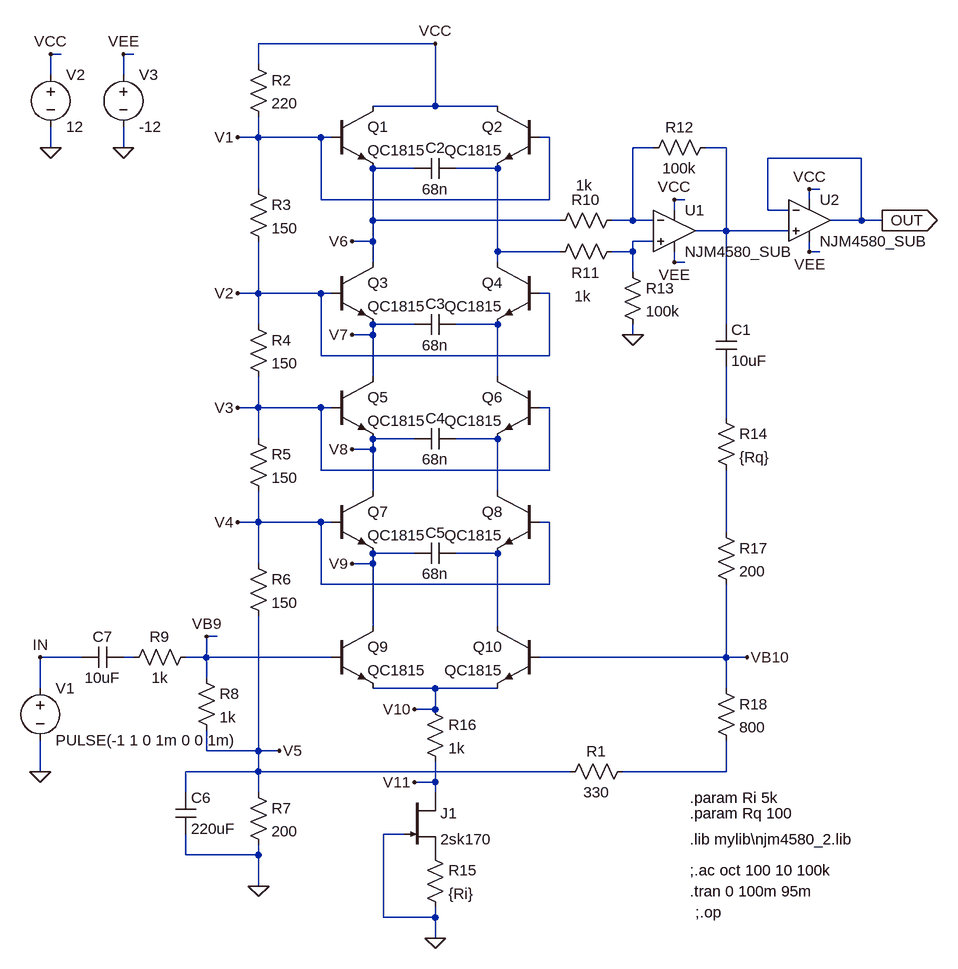
[diagram p0: schematic TLF01_V2_VF_op.asc]
TLF01_V2_VF_op.asc, the LTspice schematic file:
Version 4
SHEET 1 1344 1508
WIRE 240 -32 -32 -32
WIRE -336 -16 -352 -16
WIRE -224 -16 -240 -16
WIRE -32 0 -32 -32
WIRE -352 16 -352 -16
WIRE -240 16 -240 -16
WIRE 240 64 240 -32
WIRE 240 64 144 64
WIRE 336 64 240 64
WIRE -32 112 -32 80
WIRE -32 112 -64 112
WIRE 64 112 -32 112
WIRE 80 112 64 112
WIRE 416 112 400 112
WIRE -352 128 -352 96
WIRE -240 128 -240 96
WIRE 576 128 544 128
WIRE 688 128 656 128
WIRE 896 144 752 144
WIRE 208 160 144 160
WIRE 336 160 272 160
WIRE -32 192 -32 112
WIRE 832 192 816 192
WIRE 64 208 64 112
WIRE 416 208 416 112
WIRE 416 208 64 208
WIRE 624 208 608 208
WIRE 816 208 816 192
WIRE 608 224 608 208
WIRE 752 224 752 144
WIRE 784 224 752 224
WIRE 144 240 144 160
WIRE 432 240 144 240
WIRE 544 240 544 128
WIRE 544 240 512 240
WIRE 576 240 544 240
WIRE 896 240 896 144
WIRE 896 240 848 240
WIRE 928 240 896 240
WIRE 688 256 688 128
WIRE 688 256 640 256
WIRE 784 256 688 256
WIRE 144 272 144 240
WIRE 144 272 112 272
WIRE 576 272 544 272
WIRE 336 288 336 160
WIRE 432 288 336 288
WIRE 544 288 544 272
WIRE 544 288 512 288
WIRE 816 288 816 272
WIRE 832 288 816 288
WIRE 144 304 144 272
WIRE 336 304 336 288
WIRE 608 304 608 288
WIRE 624 304 608 304
WIRE 544 320 544 288
WIRE -32 352 -32 272
WIRE -32 352 -64 352
WIRE 64 352 -32 352
WIRE 80 352 64 352
WIRE 416 352 400 352
WIRE -32 400 -32 352
WIRE 208 400 144 400
WIRE 336 400 272 400
WIRE 688 400 688 256
WIRE 144 416 144 400
WIRE 144 416 112 416
WIRE 544 416 544 400
WIRE 64 448 64 352
WIRE 416 448 416 352
WIRE 416 448 64 448
WIRE 144 480 144 416
WIRE 336 480 336 400
WIRE -32 528 -32 480
WIRE -32 528 -64 528
WIRE 64 528 -32 528
WIRE 80 528 64 528
WIRE 416 528 400 528
WIRE 688 544 688 464
WIRE -32 576 -32 528
WIRE 208 576 144 576
WIRE 336 576 272 576
WIRE 144 592 144 576
WIRE 144 592 112 592
WIRE 64 624 64 528
WIRE 416 624 416 528
WIRE 416 624 64 624
WIRE 144 656 144 592
WIRE 336 656 336 576
WIRE -32 704 -32 656
WIRE -32 704 -64 704
WIRE 64 704 -32 704
WIRE 80 704 64 704
WIRE 416 704 400 704
WIRE 688 720 688 624
WIRE 208 752 144 752
WIRE 336 752 272 752
WIRE -32 768 -32 704
WIRE 144 768 144 752
WIRE 144 768 112 768
WIRE 64 800 64 704
WIRE 416 800 416 704
WIRE 416 800 64 800
WIRE 144 864 144 768
WIRE 336 864 336 752
WIRE -96 880 -112 880
WIRE -304 912 -368 912
WIRE -224 912 -240 912
WIRE -112 912 -112 880
WIRE -112 912 -144 912
WIRE 80 912 -112 912
WIRE 688 912 688 800
WIRE 688 912 400 912
WIRE 720 912 688 912
WIRE -112 944 -112 912
WIRE -368 960 -368 912
WIRE 240 960 144 960
WIRE 336 960 240 960
WIRE 688 960 688 912
WIRE 240 992 240 960
WIRE 240 992 208 992
WIRE -112 1056 -112 1024
WIRE -32 1056 -32 848
WIRE -32 1056 -112 1056
WIRE 0 1056 -32 1056
WIRE -368 1088 -368 1040
WIRE -32 1088 -32 1056
WIRE -32 1088 -144 1088
WIRE 448 1088 -32 1088
WIRE 688 1088 688 1040
WIRE 688 1088 528 1088
WIRE 240 1104 240 1072
WIRE 240 1104 208 1104
WIRE -144 1120 -144 1088
WIRE -32 1120 -32 1088
WIRE 240 1120 240 1104
WIRE 192 1184 160 1184
WIRE -144 1216 -144 1184
WIRE -32 1216 -32 1200
WIRE -32 1216 -144 1216
WIRE -32 1264 -32 1216
WIRE 160 1312 160 1184
WIRE 240 1312 240 1296
WIRE 240 1312 160 1312
WIRE 240 1344 240 1312
FLAG 240 1344 0
FLAG -352 128 0
FLAG -352 -16 VCC
FLAG -32 1264 0
FLAG 240 -32 VCC
FLAG -368 1088 0
FLAG -368 912 IN
FLAG -64 112 V1
FLAG -64 352 V2
FLAG -64 528 V3
FLAG -64 704 V4
FLAG 0 1056 V5
FLAG -112 880 VB9
FLAG 720 912 VB10
FLAG 608 208 VCC
FLAG 608 304 VEE
FLAG 544 416 0
FLAG -240 128 0
FLAG -240 -16 VEE
FLAG 112 272 V6
FLAG 112 416 V7
FLAG 112 592 V8
FLAG 112 768 V9
FLAG 208 992 V10
FLAG 208 1104 V11
FLAG 816 192 VCC
FLAG 816 288 VEE
FLAG 928 240 OUT
IOPIN 928 240 Out
DATAFLAG -32 112 ""
DATAFLAG -32 352 ""
DATAFLAG -32 528 ""
DATAFLAG -32 704 ""
DATAFLAG 144 272 ""
DATAFLAG 336 288 ""
DATAFLAG 144 416 ""
DATAFLAG 144 592 ""
DATAFLAG 144 768 ""
DATAFLAG 240 992 ""
DATAFLAG 240 1104 ""
DATAFLAG -32 1056 ""
DATAFLAG 688 912 ""
DATAFLAG 544 240 ""
DATAFLAG 544 288 ""
DATAFLAG 688 256 ""
DATAFLAG 688 512 ""
DATAFLAG 336 432 ""
DATAFLAG 336 608 ""
DATAFLAG 336 784 ""
DATAFLAG -112 912 ""
DATAFLAG 896 240 ""
SYMBOL npn 80 64 R0
SYMATTR InstName Q1
SYMATTR Value QC1815
SYMBOL npn 400 64 M0
SYMATTR InstName Q2
SYMATTR Value QC1815
SYMBOL npn 80 304 R0
SYMATTR InstName Q3
SYMATTR Value QC1815
SYMBOL npn 400 304 M0
SYMATTR InstName Q4
SYMATTR Value QC1815
SYMBOL npn 80 480 R0
SYMATTR InstName Q5
SYMATTR Value QC1815
SYMBOL npn 400 480 M0
SYMATTR InstName Q6
SYMATTR Value QC1815
SYMBOL npn 80 656 R0
SYMATTR InstName Q7
SYMATTR Value QC1815
SYMBOL npn 400 656 M0
SYMATTR InstName Q8
SYMATTR Value QC1815
SYMBOL cap 272 384 R90
WINDOW 0 0 32 VBottom 2
WINDOW 3 32 32 VTop 2
SYMATTR InstName C3
SYMATTR Value 68n
SYMBOL cap 272 560 R90
WINDOW 0 0 32 VBottom 2
WINDOW 3 32 32 VTop 2
SYMATTR InstName C4
SYMATTR Value 68n
SYMBOL cap 272 736 R90
WINDOW 0 0 32 VBottom 2
WINDOW 3 32 32 VTop 2
SYMATTR InstName C5
SYMATTR Value 68n
SYMBOL npn 80 864 R0
SYMATTR InstName Q9
SYMATTR Value QC1815
SYMBOL npn 400 864 M0
SYMATTR InstName Q10
SYMATTR Value QC1815
SYMBOL voltage -352 0 R0
WINDOW 123 0 0 Left 2
WINDOW 39 0 0 Left 2
SYMATTR InstName V2
SYMATTR Value 12
SYMBOL res 544 1072 R90
WINDOW 0 0 56 VBottom 2
WINDOW 3 32 56 VTop 2
SYMATTR InstName R1
SYMATTR Value 330
SYMBOL cap 672 400 R0
SYMATTR InstName C1
SYMATTR Value 10uF
SYMBOL cap 272 144 R90
WINDOW 0 0 32 VBottom 2
WINDOW 3 32 32 VTop 2
SYMATTR InstName C2
SYMATTR Value 68n
SYMBOL res -48 -16 R0
SYMATTR InstName R2
SYMATTR Value 220
SYMBOL res -48 176 R0
SYMATTR InstName R3
SYMATTR Value 150
SYMBOL res -48 384 R0
SYMATTR InstName R4
SYMATTR Value 150
SYMBOL res -48 560 R0
SYMATTR InstName R5
SYMATTR Value 150
SYMBOL res -48 752 R0
SYMATTR InstName R6
SYMATTR Value 150
SYMBOL res -48 1104 R0
SYMATTR InstName R7
SYMATTR Value 200
SYMBOL res -128 928 R0
SYMATTR InstName R8
SYMATTR Value 1k
SYMBOL res -128 896 R90
WINDOW 0 0 56 VBottom 2
WINDOW 3 32 56 VTop 2
SYMATTR InstName R9
SYMATTR Value 1k
SYMBOL cap -160 1120 R0
SYMATTR InstName C6
SYMATTR Value 220uF
SYMBOL cap -240 896 R90
WINDOW 0 0 32 VBottom 2
WINDOW 3 32 32 VTop 2
SYMATTR InstName C7
SYMATTR Value 10uF
SYMBOL res 528 224 R90
WINDOW 0 0 56 VBottom 2
WINDOW 3 -54 59 VTop 2
SYMATTR InstName R10
SYMATTR Value 1k
SYMBOL res 528 272 R90
WINDOW 0 64 56 VBottom 2
WINDOW 3 69 61 VTop 2
SYMATTR InstName R11
SYMATTR Value 1k
SYMBOL res 672 112 R90
WINDOW 0 0 56 VBottom 2
WINDOW 3 32 56 VTop 2
SYMATTR InstName R12
SYMATTR Value 100k
SYMBOL res 528 304 R0
SYMATTR InstName R13
SYMATTR Value 100k
SYMBOL voltage -240 0 R0
WINDOW 123 0 0 Left 2
WINDOW 39 0 0 Left 2
SYMATTR InstName V3
SYMATTR Value -12
SYMBOL res 672 528 R0
SYMATTR InstName R14
SYMATTR Value {Rq}
SYMBOL res 224 1200 R0
SYMATTR InstName R15
SYMATTR Value {Ri}
SYMBOL njf 192 1120 R0
SYMATTR InstName J1
SYMATTR Value 2sk170
SYMBOL res 224 976 R0
SYMATTR InstName R16
SYMATTR Value 1k
SYMBOL res 672 704 R0
SYMATTR InstName R17
SYMATTR Value 200
SYMBOL res 672 944 R0
SYMATTR InstName R18
SYMATTR Value 800
SYMBOL Opamps\\opamp2 816 176 R0
SYMATTR InstName U2
SYMATTR Value NJM4580_SUB
SYMBOL Opamps\\opamp2 608 192 R0
SYMATTR InstName U1
SYMATTR Value NJM4580_SUB
SYMBOL voltage -368 944 R0
WINDOW 123 0 0 Left 0
WINDOW 39 0 0 Left 0
SYMATTR InstName V1
SYMATTR Value PULSE(-1 1 0 1m 0 0 1m)
TEXT 632 1240 Left 2 !;.ac oct 100 10 100k
TEXT 632 1272 Left 2 !.tran 0 100m 95m
TEXT 632 1128 Left 2 !.param Ri 5k
TEXT 632 1152 Left 2 !.param Rq 100
TEXT 640 1304 Left 2 !;.op
TEXT 632 1192 Left 2 !.lib mylib\\njm4580_2.lib

The netlist it stands for:
* TLF01_V2_VF_op.asc
Q1 VCC V1 V6 0 QC1815
Q2 VCC V1 N003 0 QC1815
Q3 V6 V2 V7 0 QC1815
Q4 N003 V2 N005 0 QC1815
Q5 V7 V3 V8 0 QC1815
Q6 N005 V3 N007 0 QC1815
Q7 V8 V4 V9 0 QC1815
Q8 N007 V4 N009 0 QC1815
C3 N005 V7 68n
C4 N007 V8 68n
C5 N009 V9 68n
Q9 V9 VB9 V10 0 QC1815
Q10 N009 VB10 V10 0 QC1815
V2 VCC 0 12
R1 N011 V5 330
C1 N002 N006 10uF
C2 N003 V6 68n
R2 VCC V1 220
R3 V1 V2 150
R4 V2 V3 150
R5 V3 V4 150
R6 V4 V5 150
R7 V5 0 200
R8 VB9 V5 1k
R9 VB9 N010 1k
C6 V5 0 220uF
C7 N010 IN 10uF
R10 N001 V6 1k
R11 N004 N003 1k
R12 N002 N001 100k
R13 N004 0 100k
V3 VEE 0 -12
R14 N006 N008 {Rq}
R15 P001 0 {Ri}
J1 V11 0 P001 2sk170
R16 V10 V11 1k
R17 N008 VB10 200
R18 VB10 N011 800
XU2 N002 OUT VCC VEE OUT NJM4580_SUB  ; pins In+ In- V+ V- OUT
XU1 N004 N001 VCC VEE N002 NJM4580_SUB  ; pins In+ In- V+ V- OUT
V1 IN 0 PULSE(-1 1 0 1m 0 0 1m)
.model NPN NPN
.model PNP PNP
.lib standard.bjt
.model NJF NJF
.model PJF PJF
.lib standard.jft
;.ac oct 100 10 100k
.tran 0 100m 95m
.param Ri 5k
.param Rq 100
;.op
.lib mylib\njm4580_2.lib
.backanno
.end